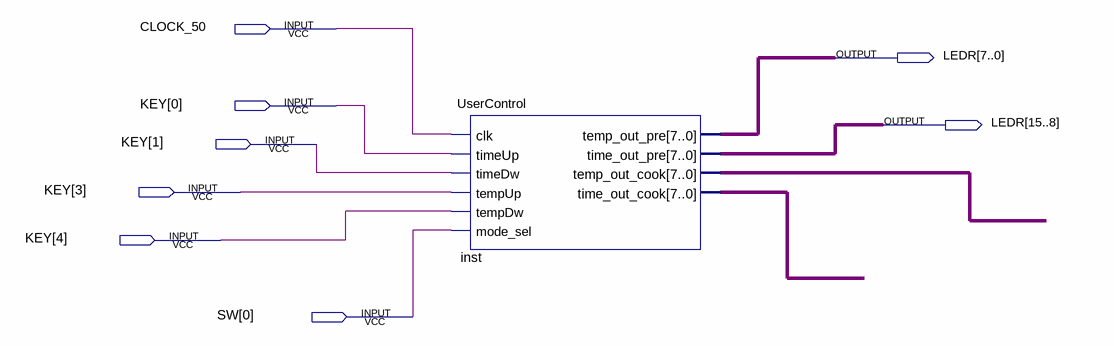
[diagram p0: schematic sheet]
// Quartus schematic User_Control_Demo.bdf as structural Verilog: 1 symbols, 8 pins
module User_Control_Demo (
  input  CLOCK_50,
  input  [4:0] KEY,
  input  [0:0] SW,
  output [15:0] LEDR
);

  wire [7:0] inst_temp_out_cook, inst_time_out_cook;

  UserControl inst (
    .clk(CLOCK_50), .timeUp(KEY[0]), .timeDw(KEY[1]), .tempUp(KEY[3]), .tempDw(KEY[4]), .mode_sel(SW[0]),
    .temp_out_pre(LEDR[7:0]), .time_out_pre(LEDR[15:8]), .temp_out_cook(inst_temp_out_cook),
    .time_out_cook(inst_time_out_cook));
endmodule
